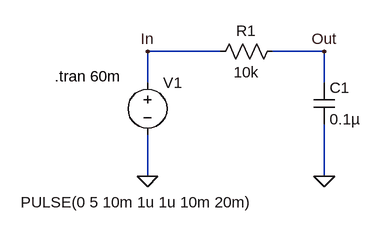
[diagram p0: schematic Tutorial1.asc]
Tutorial1.asc, the LTspice schematic file:
Version 4.1
SHEET 1 880 680
WIRE 192 64 80 64
WIRE 352 64 272 64
WIRE 80 112 80 64
WIRE 352 112 352 64
WIRE 80 256 80 192
WIRE 352 256 352 176
FLAG 80 256 0
FLAG 352 256 0
FLAG 80 64 In
FLAG 352 64 Out
SYMBOL voltage 80 96 R0
WINDOW 3 -195 200 Left 2
WINDOW 123 0 0 Left 0
WINDOW 39 0 0 Left 0
SYMATTR InstName V1
SYMATTR Value PULSE(0 5 10m 1u 1u 10m 20m)
SYMBOL res 288 48 R90
WINDOW 0 0 56 VBottom 2
WINDOW 3 32 56 VTop 2
SYMATTR InstName R1
SYMATTR Value 10k
SYMBOL cap 336 112 R0
SYMATTR InstName C1
SYMATTR Value 0.1µ
TEXT -63 102 Left 2 !.tran 60m

The netlist it stands for:
* Tutorial1.asc
V1 In 0 PULSE(0 5 10m 1u 1u 10m 20m)
R1 Out In 10k
C1 Out 0 0.1µ
.tran 60m
.backanno
.end

* Results of the author's LTspice run, read from the files saved beside the schematic
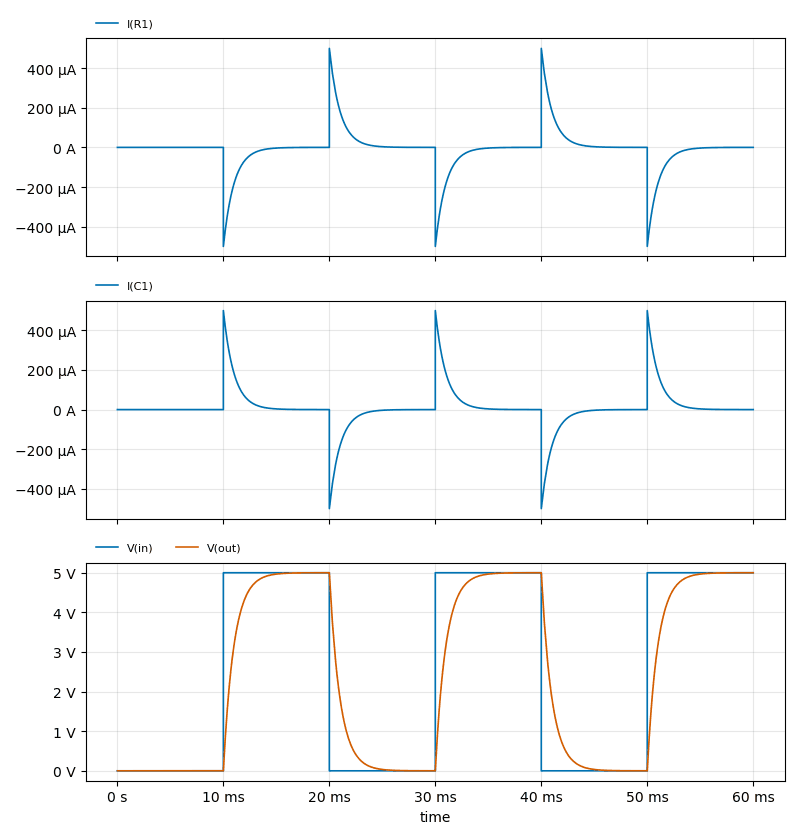
[diagram p1: Transient Analysis of Tutorial1.asc, plotted from the saved traces]
* Transient Analysis, 1 run:
*   I(R1): min -499.7 µA, max 499.7 µA, average -8.289 µA, rms 102.6 µA, last -22.65 nA
*   I(C1): min -499.7 µA, max 499.7 µA, average 8.289 µA, rms 102.6 µA, last 22.65 nA
*   V(in): min 0 V, max 5 V, average 2.5 V, rms 3.536 V, last 5 V
*   V(out): min 0 V, max 5 V, average 2.417 V, rms 3.324 V, last 5 V